# EAGLE schematic Schematic_v20 (EAGLE 9.6.2)
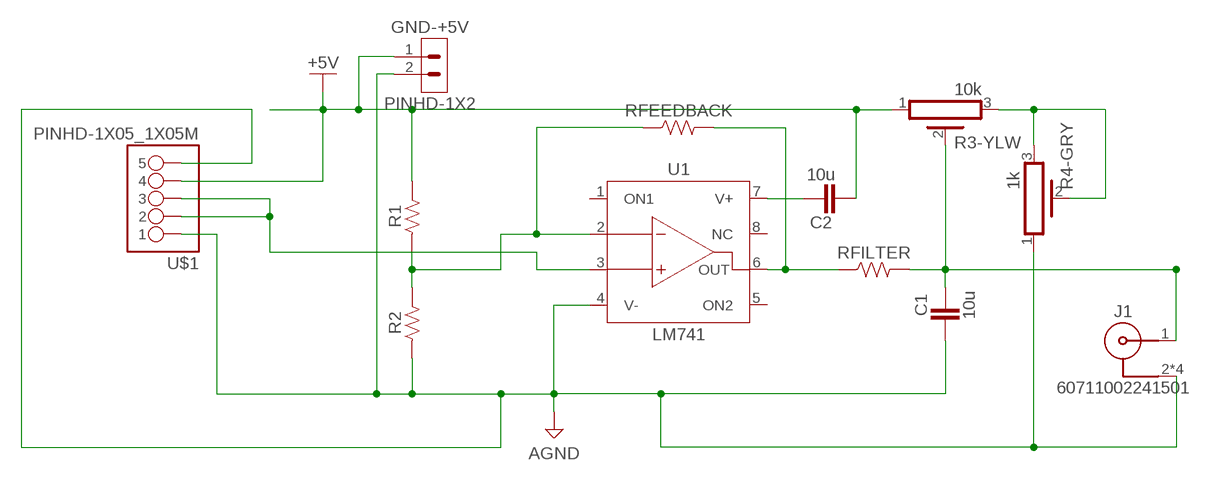
[diagram p0: schematic, sheet 1]

## Parts
C1  10u  CAPACITORCERAMIC-2.54MM  [CAP-THRU-2.54MM]
C2  10u  CAPACITORCERAMIC-2.54MM  [CAP-THRU-2.54MM]
GND-+5V  PINHD-1X2  [1X02]
J1  60711002241501  60711002241501  [60711002241501]
R1  1k  R-US_AXIAL-7.2MM-PITCH  [RESAD724W46L381D178B]
R2  1k  R-US_AXIAL-7.2MM-PITCH  [RESAD724W46L381D178B]
R3-YLW  10k  POT_HA-06  [HA-06-SM065]
R4-GRY  1k  POT_HA-06  [HA-06-SM065]
RFEEDBACK  24M  R-US_AXIAL-7.2MM-PITCH  [RESAD724W46L381D178B]
RFILTER  47k  R-US_AXIAL-7.2MM-PITCH  [RESAD724W46L381D178B]
U1  LM741  [DIP826W53P254L959H508Q8B]
U$1  PINHD-1X05_1X05M  [1X05]

## Nets
+5V: C2.2 GND-+5V.1 R1.2 R3-YLW.1 U$1.4
AGND: C1.2 GND-+5V.2 J1.2 J1.3 J1.4 J1.5 R2.1 R4-GRY.1 U1.4(V-) U$1.1 U$1.5
N$1: C2.1 U1.7(V+)
N$2: C1.1 J1.1 R3-YLW.2 RFILTER.2
N$3: RFEEDBACK.2 RFILTER.1 U1.6(OUT)
N$5: U1.3(+IN) U$1.2 U$1.3
N$6: R1.1 R2.2 RFEEDBACK.1 U1.2(-IN)
N$7: R3-YLW.3 R4-GRY.2 R4-GRY.3
Unconnected: U1.1(ON1) U1.5(ON2) U1.8(NC)

## Library data of the parts
C1 C2 = Tinkercad:CAPACITOR: Capacitor - Generic
GND-+5V = Connector:PINHD-1X2: Pin Header; CATEGORY: Connectors; DESCRIPTION: Header-Straight-2 Position; PACKAGE_TYPE: Through Hole; PITCH: 0.100" (2.54mm); SUBCATEGORY: Headers; TYPE: Male Pins
J1 = Wurth_Connectors_WR-BNC:60711002241501: WR-BNC BNC PCB Connectors Characteristics Interface: MIL-STD-348 Mating Cycle: 200 Cycles Impedance: 50Ω Insulation Resistance: 5000MΩ(min.) Withstanding Voltage: 1500Vrms(min.) Plating: Nickel and Gold Mating: bayonet lock Applications Network and communications RF Test and measurement equipment Industrial applications High power machinery Outdoor or humidity environment <https://www.we-online.com/components/media/o776800v209%20Family-WR-BNC%20PCB.jpg> Details see: www.we-online.com/en/components/products/BNC_CONNECTORS_PCB_CONNECTORS <www.we-online.com/catalog/BNC_CONNECTORS_PCB_CONNECTORS/?utm_source=eagle_model&utm_medium=description_link&utm_campaign=eisos_eagle> Created by Ella Wu 2024-05-29 2024 (C) Wurth Elektronik; DATASHEET-URL: https://www.we-online.com/redexpert/spec/60711002241501?ae; FREQUENCY-RANGE: DC~1 GHz; MOUNT: THT; OPERATING-TEMPERATURE: -65 °C up to +165 °C; PART-NUMBER: 60711002241501; SIZE: Right Angle Jack
R1 R2 RFEEDBACK RFILTER = Resistor:R-US: Resistor Fixed - ANSI; CATEGORY: Resistors; DESCRIPTION: Axial Resistor 7.24 mm pitch 3.81 mm body length 1.78 mm body diameter; PACKAGE_SIZE: Axial; PACKAGE_TYPE: Through Hole
R3-YLW R4-GRY = Tinkercad:POT: Rectangular Trimmer Potentiometers - PV36 Series Datasheet <https://www.bourns.com/docs/Product-Datasheets/pv36.pdf>
U1 = IC_Linear:LM741: Operational Amplifier Reference: Datasheet <https://www.ti.com/lit/ds/symlink/lm741.pdf>; CATEGORY: Linear ICs; DESCRIPTION: General Purpose Amplifier 1 Circuit 8-PDIP; PACKAGE_SIZE: 8-PDIP; PACKAGE_TYPE: Through Hole; ROHS: Compliant; SERIES: LM741; SUBCATEGORY: Amplifiers; TYPE: General Purpose
U$1 = Tinkercad:PINHD-1X05